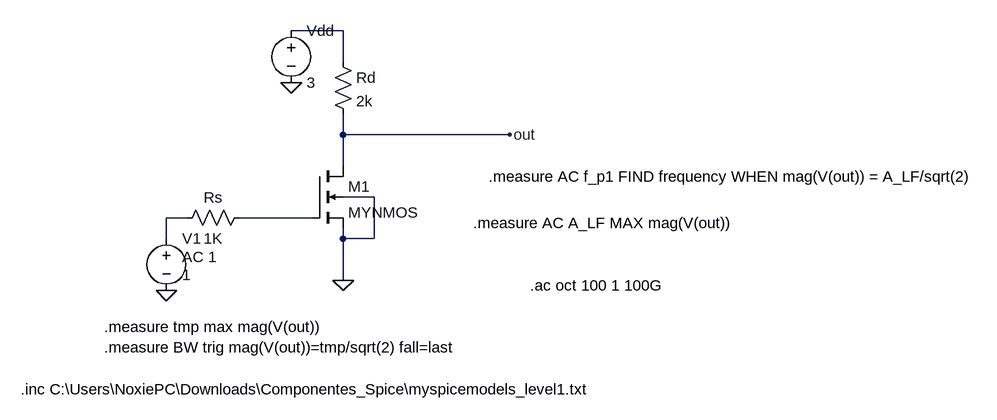
[diagram p0: schematic Circuito6_3.asc]
Circuito6_3.asc, the LTspice schematic file:
Version 4.1
SHEET 1 1260 680
WIRE 224 -496 144 -496
WIRE 224 -448 224 -496
WIRE 224 -336 224 -368
WIRE 480 -336 224 -336
WIRE 224 -288 224 -336
WIRE 272 -240 224 -240
WIRE -16 -208 -48 -208
WIRE 176 -208 64 -208
WIRE -48 -176 -48 -208
WIRE 224 -176 224 -192
WIRE 272 -176 272 -240
WIRE 272 -176 224 -176
WIRE 224 -112 224 -176
FLAG 224 -112 0
FLAG -48 -96 0
FLAG 144 -416 0
FLAG 480 -336 out
SYMBOL nmos4 176 -288 R0
SYMATTR InstName M1
SYMATTR Value MYNMOS
SYMATTR Value2 l=0.5u w=50u ad=50p as=50p pd=102u ps=102u
SYMBOL res 80 -224 R90
WINDOW 0 0 56 VBottom 2
WINDOW 3 32 56 VTop 2
SYMATTR InstName Rs
SYMATTR Value 1K
SYMBOL res 208 -464 R0
SYMATTR InstName Rd
SYMATTR Value 2k
SYMBOL voltage 144 -512 R0
WINDOW 123 0 0 Left 0
WINDOW 39 0 0 Left 0
SYMATTR InstName Vdd
SYMATTR Value 3
SYMBOL voltage -48 -192 R0
WINDOW 123 24 44 Left 2
WINDOW 39 0 0 Left 0
WINDOW 3 24 72 Left 2
SYMATTR Value2 AC 1
SYMATTR Value 1
SYMATTR InstName V1
TEXT -272 56 Left 2 !.inc C:\\Users\\NoxiePC\\Downloads\\Componentes_Spice\\myspicemodels_level1.txt
TEXT 512 -104 Left 2 !.ac oct 100 1 100G
TEXT -144 -40 Left 2 !.measure tmp max mag(V(out))\n.measure BW trig mag(V(out))=tmp/sqrt(2) fall=last
TEXT 448 -272 Left 2 !.measure AC f_p1 FIND frequency WHEN mag(V(out)) = A_LF/sqrt(2)
TEXT 424 -200 Left 2 !.measure AC A_LF MAX mag(V(out))

The netlist it stands for:
* Circuito6_3.asc
M1 out N003 0 0 MYNMOS l=0.5u w=50u ad=50p as=50p pd=102u ps=102u
Rs N003 N002 1K
Rd N001 out 2k
Vdd N001 0 3
V1 N002 0 1 AC 1
.model NMOS NMOS
.model PMOS PMOS
.lib standard.mos
.inc C:\Users\NoxiePC\Downloads\Componentes_Spice\myspicemodels_level1.txt
.ac oct 100 1 100G
.measure tmp max mag(V(out))
.measure BW trig mag(V(out))=tmp/sqrt(2) fall=last
.measure AC f_p1 FIND frequency WHEN mag(V(out)) = A_LF/sqrt(2)
.measure AC A_LF MAX mag(V(out))
.backanno
.end